# Altium schematic sheet 07-I225-2.SchDoc
size B; SheetNumber: 7; SheetTotal: 12
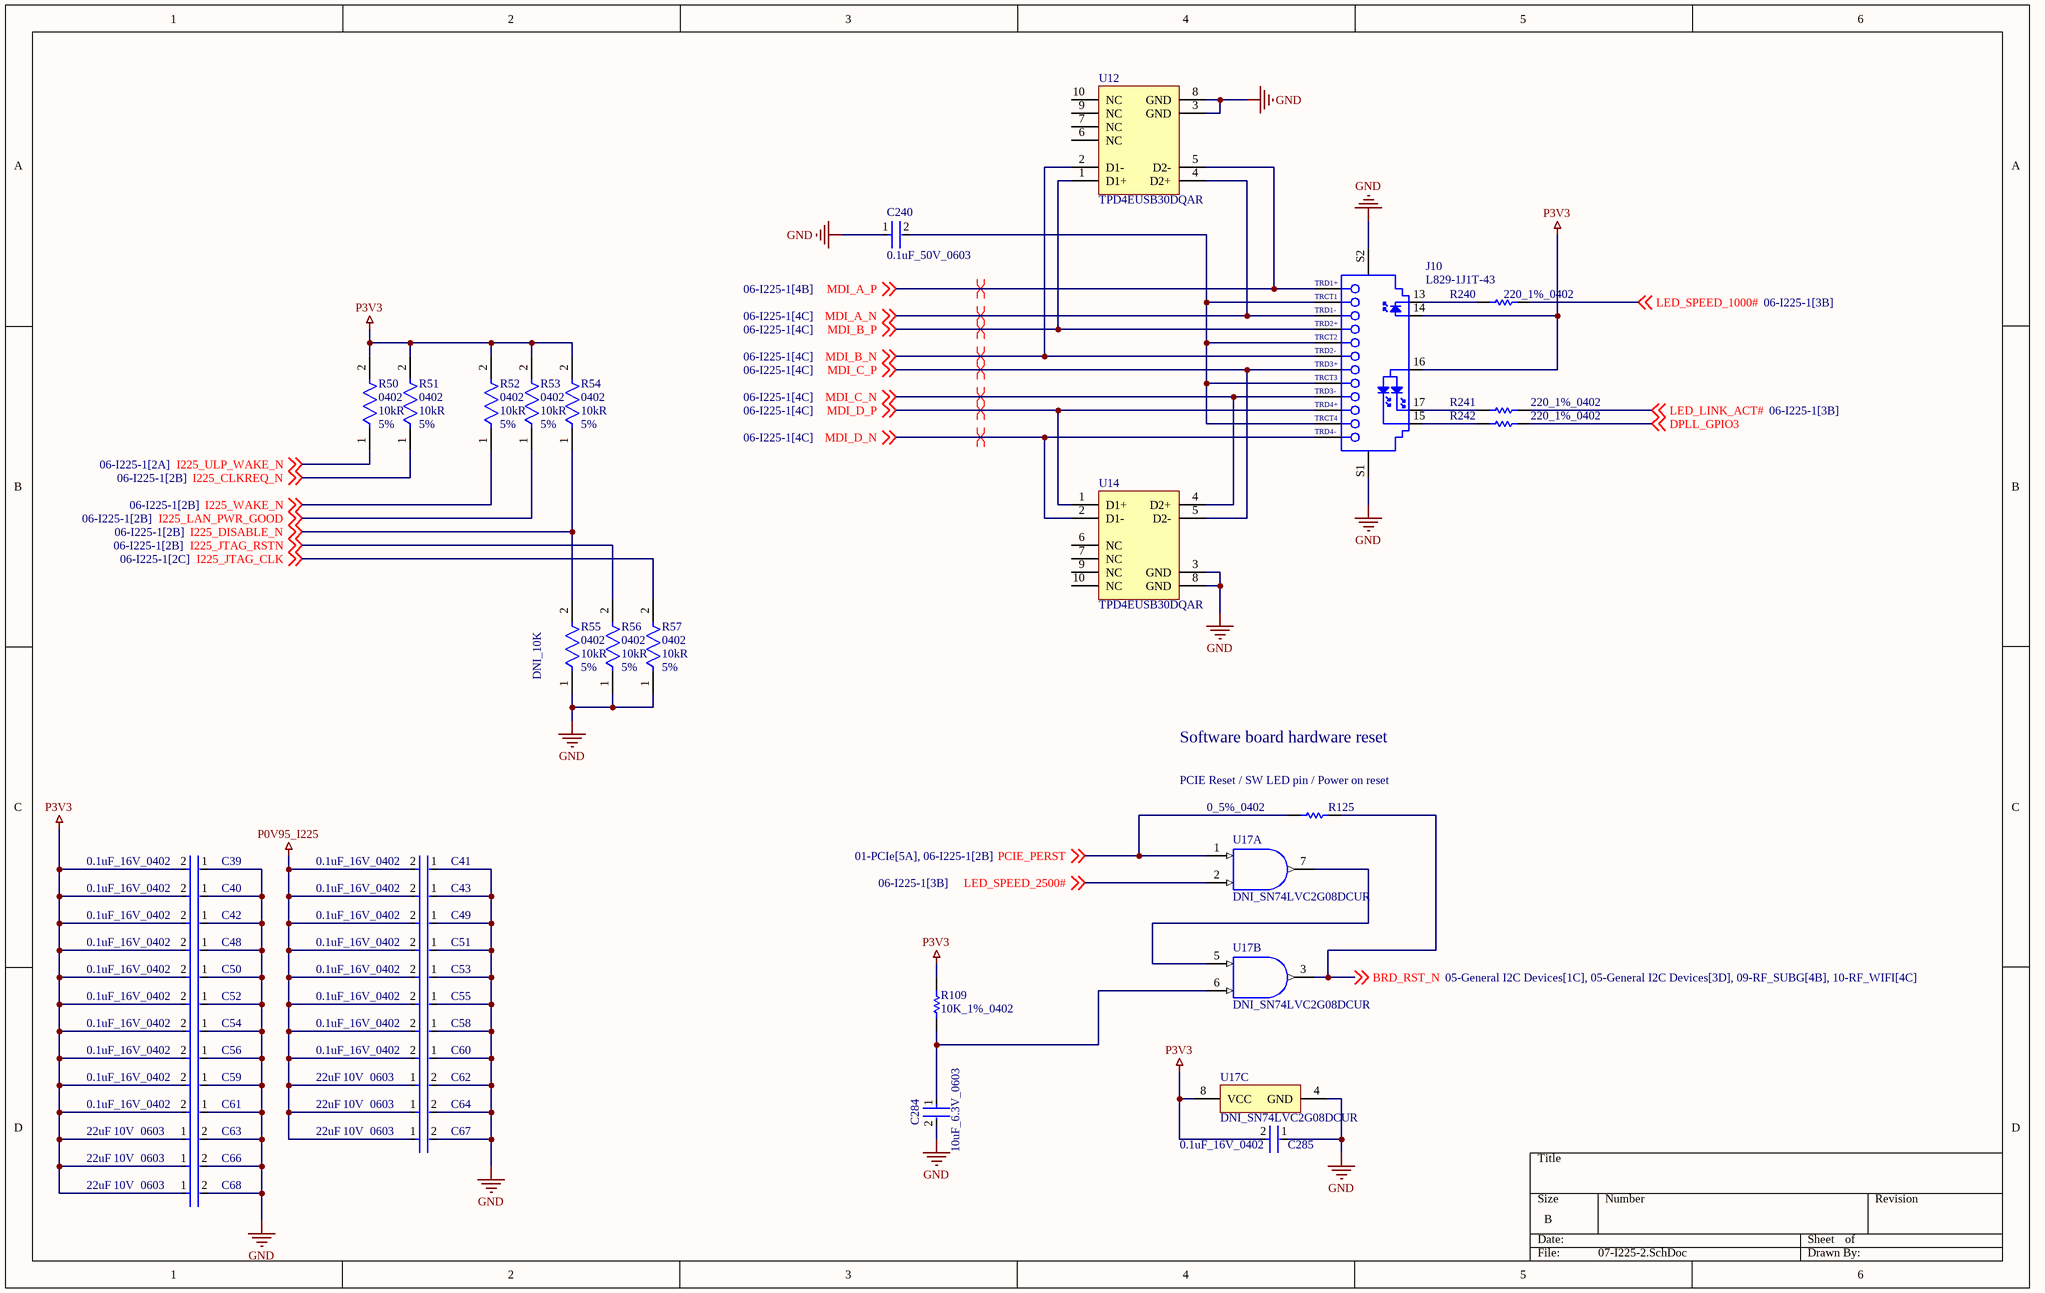
[diagram p0: 07-I225-2.SchDoc]

## Parts
C39  0.1uF_16V_0402  [FP-GRM15-MFG]
C40  0.1uF_16V_0402  [FP-GRM15-MFG]
C41  0.1uF_16V_0402  [FP-GRM15-MFG]
C42  0.1uF_16V_0402  [FP-GRM15-MFG]
C43  0.1uF_16V_0402  [FP-GRM15-MFG]
C48  0.1uF_16V_0402  [FP-GRM15-MFG]
C49  0.1uF_16V_0402  [FP-GRM15-MFG]
C50  0.1uF_16V_0402  [FP-GRM15-MFG]
C51  0.1uF_16V_0402  [FP-GRM15-MFG]
C52  0.1uF_16V_0402  [FP-GRM15-MFG]
C53  0.1uF_16V_0402  [FP-GRM15-MFG]
C54  0.1uF_16V_0402  [FP-GRM15-MFG]
C55  0.1uF_16V_0402  [FP-GRM15-MFG]
C56  0.1uF_16V_0402  [FP-GRM15-MFG]
C58  0.1uF_16V_0402  [FP-GRM15-MFG]
C59  0.1uF_16V_0402  [FP-GRM15-MFG]
C60  0.1uF_16V_0402  [FP-GRM15-MFG]
C61  0.1uF_16V_0402  [FP-GRM15-MFG]
C62  Capacitance: 22uF  Voltage Rating: 10V  Case Code (Imperial): 0603  [FP-GRM188-0_2-IPC_C]  (hidden comment: GRM188R61A226ME15D)
C63  Capacitance: 22uF  Voltage Rating: 10V  Case Code (Imperial): 0603  [FP-GRM188-0_2-IPC_C]  (hidden comment: GRM188R61A226ME15D)
C64  Capacitance: 22uF  Voltage Rating: 10V  Case Code (Imperial): 0603  [FP-GRM188-0_2-IPC_C]  (hidden comment: GRM188R61A226ME15D)
C66  Capacitance: 22uF  Voltage Rating: 10V  Case Code (Imperial): 0603  [FP-GRM188-0_2-IPC_C]  (hidden comment: GRM188R61A226ME15D)
C67  Capacitance: 22uF  Voltage Rating: 10V  Case Code (Imperial): 0603  [FP-GRM188-0_2-IPC_C]  (hidden comment: GRM188R61A226ME15D)
C68  Capacitance: 22uF  Voltage Rating: 10V  Case Code (Imperial): 0603  [FP-GRM188-0_2-IPC_C]  (hidden comment: GRM188R61A226ME15D)
C240  0.1uF_50V_0603  [FP-C0603-CJ-MFG]
C284  10uF_6.3V_0603  [FP-C0603C106M9PACTU-MFG]
C285  0.1uF_16V_0402  [FP-GRM15-MFG]
J10  L829-1J1T-43  [BELS-L829-1J1T-43_V]
R50  Case/Package: 0402  Resistance: 10kR  Tolerance: 5%  [FP-CRCW0402-e3-IPC_B]  (hidden comment: CRCW040210K0JNED)
R51  Case/Package: 0402  Resistance: 10kR  Tolerance: 5%  [FP-CRCW0402-e3-IPC_B]  (hidden comment: CRCW040210K0JNED)
R52  Case/Package: 0402  Resistance: 10kR  Tolerance: 5%  [FP-CRCW0402-e3-IPC_B]  (hidden comment: CRCW040210K0JNED)
R53  Case/Package: 0402  Resistance: 10kR  Tolerance: 5%  [FP-CRCW0402-e3-IPC_B]  (hidden comment: CRCW040210K0JNED)
R54  Case/Package: 0402  Resistance: 10kR  Tolerance: 5%  [FP-CRCW0402-e3-IPC_B]  (hidden comment: CRCW040210K0JNED)
R55  DNI_10K  Case/Package: 0402  Resistance: 10kR  Tolerance: 5%  [FP-CRCW0402-e3-IPC_B]  (no BOM)
R56  Case/Package: 0402  Resistance: 10kR  Tolerance: 5%  [FP-CRCW0402-e3-IPC_B]  (hidden comment: CRCW040210K0JNED)
R57  Case/Package: 0402  Resistance: 10kR  Tolerance: 5%  [FP-CRCW0402-e3-IPC_B]  (hidden comment: CRCW040210K0JNED)
R109  10K_1%_0402  [RESC1005X40X25NL10T10]
R125  0_5%_0402  [RESC1005X40X25LL10T10]
R240  220_1%_0402  [RESC1005X40X25LL10T10]
R241  220_1%_0402  [RESC1005X40X25LL10T10]
R242  220_1%_0402  [RESC1005X40X25LL10T10]
U12  TPD4EUSB30DQAR  [DQA0010A_V]
U14  TPD4EUSB30DQAR  [DQA0010A_V]
U17  DNI_SN74LVC2G08DCUR  [DCU0008A_M]  (parts A,B,C of 3)  (no BOM)

## Nets
GND: C39.1 C40.1 C41.1 C42.1 C43.1 C48.1 C49.1 C50.1 C51.1 C52.1 C53.1 C54.1 C55.1 C56.1 C58.1 C59.1 C60.1 C61.1 C62.2 C63.2 C64.2 C66.2 C67.2 C68.2 C240.1 C284.2 C285.1 J10.S1 J10.S2 R55.1 R56.1 R57.1 U12.3(GND) U12.8(GND) U14.3(GND) U14.8(GND) U17.4(GND)
P0V95_I225: C41.2 C43.2 C49.2 C51.2 C53.2 C55.2 C58.2 C60.2 C62.1 C64.1 C67.1
P3V3: C39.2 C40.2 C42.2 C48.2 C50.2 C52.2 C54.2 C56.2 C59.2 C61.2 C63.1 C66.1 C68.1 C285.2 J10.14 J10.16 R50.2 R51.2 R52.2 R53.2 R54.2 R109.2 U17.8(VCC)
BRD_RST_N: R125.2 U17.3(2Y) ; off-sheet BRD_RST_N
DPLL_GPIO3: R242.2 ; off-sheet DPLL_GPIO3
I225_CLKREQ_N: R51.1 ; off-sheet I225_CLKREQ_N
I225_DISABLE_N: R54.1 R55.2 ; off-sheet I225_DISABLE_N
I225_JTAG_CLK: R57.2 ; off-sheet I225_JTAG_CLK
I225_JTAG_RSTN: R56.2 ; off-sheet I225_JTAG_RSTN
I225_LAN_PWR_GOOD: R53.1 ; off-sheet I225_LAN_PWR_GOOD
I225_ULP_WAKE_N: R50.1 ; off-sheet I225_ULP_WAKE_N
I225_WAKE_N: R52.1 ; off-sheet I225_WAKE_N
LED_LINK_ACT#: R241.2 ; off-sheet LED_LINK_ACT#
LED_SPEED_1000#: R240.2 ; off-sheet LED_SPEED_1000#
LED_SPEED_2500#: U17.2(1B) ; off-sheet LED_SPEED_2500#
MDI_A_N: J10.3(TRD1-) U12.4(D2+) ; off-sheet MDI_A_N
MDI_A_P: J10.1(TRD1+) U12.5(D2-) ; off-sheet MDI_A_P
MDI_B_N: J10.6(TRD2-) U12.2(D1-) ; off-sheet MDI_B_N
MDI_B_P: J10.4(TRD2+) U12.1(D1+) ; off-sheet MDI_B_P
MDI_C_N: J10.9(TRD3-) U14.4(D2+) ; off-sheet MDI_C_N
MDI_C_P: J10.7(TRD3+) U14.5(D2-) ; off-sheet MDI_C_P
MDI_D_N: J10.12(TRD4-) U14.2(D1-) ; off-sheet MDI_D_N
MDI_D_P: J10.10(TRD4+) U14.1(D1+) ; off-sheet MDI_D_P
PCIE_PERST: R125.1 U17.1(1A) ; off-sheet PCIE_PERST
NetC240_2: C240.2 J10.2(TRCT1) J10.5(TRCT2) J10.8(TRCT3) J10.11(TRCT4)
NetC284_1: C284.1 R109.1 U17.6(2B)
NetJ10_13: J10.13 R240.1
NetJ10_15: J10.15 R242.1
NetJ10_17: J10.17 R241.1
NetU17_5: U17.5(2A) U17.7(1Y)

Not connected (* = marked no-connect by the designer): U12 6(NC) 7(NC) 9(NC) 10(NC); U14 6(NC) 7(NC) 9(NC) 10(NC)

## Layout directives
differential pair: MDI_A_N, MDI_A_P, MDI_B_N, MDI_B_P, MDI_C_N, MDI_C_P, MDI_D_N, MDI_D_P

## Notes on the sheet
- Software board hardware reset
- (near R125) PCIE Reset / SW LED pin / Power on reset

## Library data of the parts
C39-C43 C48-C56 C58-C61 C285 = CMP-2100-03641-2: CAP CER 0.1UF 16V X7R 0402; Manufacturer Part Number: GRM155R71C104KA88D; Manufacturer: Murata; Standoff Height: 0mm; Tolerance: 10%; Voltage Rating: 16Vdc; Material: Ceramic; Capacitance: 0.10μF; Value: 0.10μF; RoHS: TRUE; Temperature Characteristic: X7R; Octopart: https://octopart.com/grm155r71c104ka88d-murata-196880; Digikey Description: CAP CER 0.1UF 16V X7R 0402; Device Class L3: Ceramic Capacitors; Height: 0.55mm; ComponentLink2Description: Datasheet; Temperature Range Low: -55°C; Ipc Land Pattern Name: CAPC10050X219; ComponentLink2URL: https://search.murata.co.jp/Ceramy/image/img/A01X/G101/ENG/GRM155R71H471KA01-01A.pdf; Device Class L1: Passive Components; Lead Free: yes; Category: Cap; Package: GRM15; Temperature: -55°C to +125°C; Device Class L2: Capacitors; Temperature Range High: +125°C; Mouser Description: 0402 0.1 uF 16V ±10 % Tolerance X7R SMT Multilayer Ceramic Capacitor
C62-C64 C66-C68 = CMP-2000-06337-3: Chip Multilayer Ceramic Capacitors for General Purpose, 0603, 22uF, X5R, 15%, 20%, 10V; Tolerance: 20%; Weight: 0.000222oz; Material: Ceramic; Depth: 0.8mm; Length: 1.6mm; Termination: SMD/SMT; Packaging: Tape and Reel; Width: 0.8mm; Mount: Surface Mount; Voltage Rating (DC): 10V; Case/Package: 0603; Thickness: 0.039inch; REACH SVHC: No SVHC; Dielectric: X5R; Height: 0.8mm; Package Quantity: 4000; Case Code (Metric): 1608; Min Operating Temperature: -55°C; Lead Free: Lead Free; Max Operating Temperature: 85°C
C240 = CMP-2006-03300-2: CAP CER 0.1UF 50V X7R 0603; Manufacturer Part Number: C0603X104K5RACTU; Manufacturer: Kemet; Capacitance: 100nF; Material: Ceramic; Tolerance: 10%; Value: 100nF; Temperature Coefficient: 15%; Temperature Range High: +125°C; Temperature Range Low: -55°C; Voltage: 50V; ComponentLink2Description: Datasheet; RoHS: TRUE; ComponentLink2URL: https://content.kemet.com/datasheets/KEM_C1013_X7R_FT-CAP_SMD.pdf; Device Class L3: Ceramic Capacitors; Device Class L2: Capacitors; Package: C0603-CJ; Height: 0.95mm; Device Class L1: Passive Components; Temperature Characteristic: X7R; Lead Free: Yes; Digikey Description: CAP CER 0.1UF 50V X7R 0603; Automotive: No; Mouser Description: Capacitor; Ceramic; Cap 0.1uF; Tol+10%; SMT; Flexible Termination; Vol-Rtg 50V; TR; Temperature: -55°C to +125°C; Octopart: https://octopart.com/c0603x104k5ractu-kemet-9145062; Category: Cap; Voltage Rating: 50V; Ipc Land Pattern Name: CAPC16080X80
C284 = CMP-2006-02285-3: CAP CER 10UF 6.3V X5R 0603; Manufacturer Part Number: C0603C106M9PACTU; Manufacturer: Kemet; Material: Ceramic; Temperature Coefficient: 15%; Tolerance: 20%; Category: Cap; Height: 0.9mm; Digikey Description: CAP CER 10UF 6.3V X5R 0603; Mouser Description: In a Pack of 10, KEMET 0603 (1608M) 10µF MLCC 6.3V dc ±20% SMD C0603C106M9PACTU; Voltage Rating: 6.3V; Device Class L2: Capacitors; Temperature Range Low: -55°C; Temperature Characteristic: X5R; ComponentLink2Description: Datasheet; Ipc Land Pattern Name: CAPC16080X80; ComponentLink2URL: http://www.kemet.com/Lists/ProductCatalog/Attachments/19/KEM_C1006_X5R_SMD.pdf; Capacitance: 10uF; Temperature Range High: +85°C; Device Class L3: Ceramic Capacitors; RoHS: TRUE; Automotive: No; Value: 10uF; Temperature: -55°C to +85°C; Device Class L1: Passive Components; Package: C0603C106M9PACTU; Lead Free: Yes; Octopart: https://octopart.com/c0603c106m9pactu-kemet-8375727
J10 = CMP-1715-00001-1: Gigabit MagJack(R) Ultra Low Profile, 10/100/1000 Base-T, 19-Pin THD, RoHS, Tray; Width: 24.13 mm; RoHSCompliant: True; PartNumber: L829-1J1T-43; Case/Package: Metal; Mount: Through Hole; ComponentLink1Description: Manufacturer URL; Height: 11.3 mm; Package Quantity: 60; Packaging: Tray; Length: 17.78 mm; PackageDescription: 19-Pin Through Hole Device, Body 23.94 x 17.58 mm, Pitch 2.03 mm; ComponentLink2URL: http://belfuse.com/pdfs/L829-1J1T-43.pdf; ComponentLink1URL: http://belfuse.com/ethernet/; Mounting Technology: Through Hole; DatasheetVersion: Rev. G; Pins: 8; ComponentLink2Description: Datasheet
R50-R57 = CMP-2002-08136-3: RES Thick Film, 10kΩ, 5%, 0.063W, 200ppm/°C, 0402; Voltage Rating: 50V; Power Rating: 63mW; Military Standard: Not; Packaging: Tape and Reel; Case Code (Imperial): 0402; Min Operating Temperature: -55°C; Case Code (Metric): 1005; Temperature Coefficient: 200ppm/°C; Termination: SMD/SMT; Composition: Thick Film; Depth: 0.5mm; Number of Terminations: 2; Contact Plating: Tin; Height: 0.016inch; Width: 0.5mm; Max Operating Temperature: 155°C; Features: Automotive AEC-Q200; Length: 1mm; Radiation Hardening: No; Max Power Dissipation: 63mW; Mount: Surface Mount; Package Quantity: 1; Weight: 2.3E-05oz
R109 = CMP-2002-04694-1: Manufacturer: Bourns; Part Number: CR0402-FX-1002GLF
R125 = CMP-2002-04569-1: Manufacturer: KOA Speer; Part Number: RK73Z1ETTP
R240-R242 = CMP-2002-03891-1: Part Number: RK73H1ETTP2200F; Manufacturer: KOA Speer
U12 U14 = CMP-0326-00027-3: ESD Solution for Super-Speed (6 GBPS) USB 3.0 Interface, 4 Channels, -40 to +85 degC, 10-pin SON (DQA), Green (RoHS & no Sb/Br); Manufacturer: Texas Instruments; Differential Capacitance(pF): 0.05; Serial ATA / eSATA: TRUE; IO Capacitance(Typ)(pF): 0.8; IO Leakage Current(nA): 10; IEC 61000-4-2 Air-Gap(+/- kV): 8; ComponentLink3Description: URL Link1; PartNumber: TPD4EUSB30DQAR; DatasheetVersion: SLVSAC2C; ComponentLink2URL: http://www.ti.com/general/docs/lit/getliterature.tsp?genericPartNumber=TPD4EUSB30&fileType=pdf; USB Super Speed: TRUE; Eco-Plan: Green (RoHS & no Sb/Br); Mounting Technology: Surface Mount; 1394 / Firewire: TRUE; PackageVersion: revB, Sep-2009; SubFamily: ESD Solution; USB Full Speed: TRUE; USB High Speed: TRUE; ComponentLink2Description: Datasheet; ComponentLink1URL: http://www.ti.com/; IEC 61000-4-2 Contact(+/- kV): 8; Breakdown Voltage(Min)(V): 8; PackageReference: DQA0010A; ComponentLink1Description: Manufacturer URL; PackageDescription: 10-Pin Plastic Small Outline No-Lead, 1 x 2.5 x 0.55 mm Body, 0.5 mm Pitch; ComponentLink3URL: SamplesURL:http://www.ti.com/product/tpd4eusb30#samples; HDMI: TRUE
U17 = CMP-0859-00670-3: Dual 2-Input Positive-AND Gate, DCU0008A, LARGE T&R; Manufacturer: Texas Instruments; Logic: True; Output Drive (IOL/IOH)(Max)(mA): 32/-32; F @ Nom Voltage(Max)(Mhz): 150; Technology Family: LVC; Rating: Catalog; tpd @ Nom Voltage(Max)(ns): 9.8,5.8,5.3,4.8; Voltage(Nom)(V): 1.8,2.5,3.3,5; Schmitt Trigger: No; Input Type: CMOS/TTL; Bits(#): 2; Gate Type: AND; VCC(Max)(V): 5.5; VCC(Min)(V): 1.65; ICC @ Nom Voltage(Max)(mA): 0.01; Output Type: CMOS; Sub-Family: AND Gate; PackageReference: DCU0008A; Operating Temperature Range(C): -40 to 125,-40 to 85; 3-State Output: No; DatasheetVersion: SCES198M; Generic Part Number: SN74LVC2G08